# EAGLE design Main_Board (EAGLE 9.2.0)
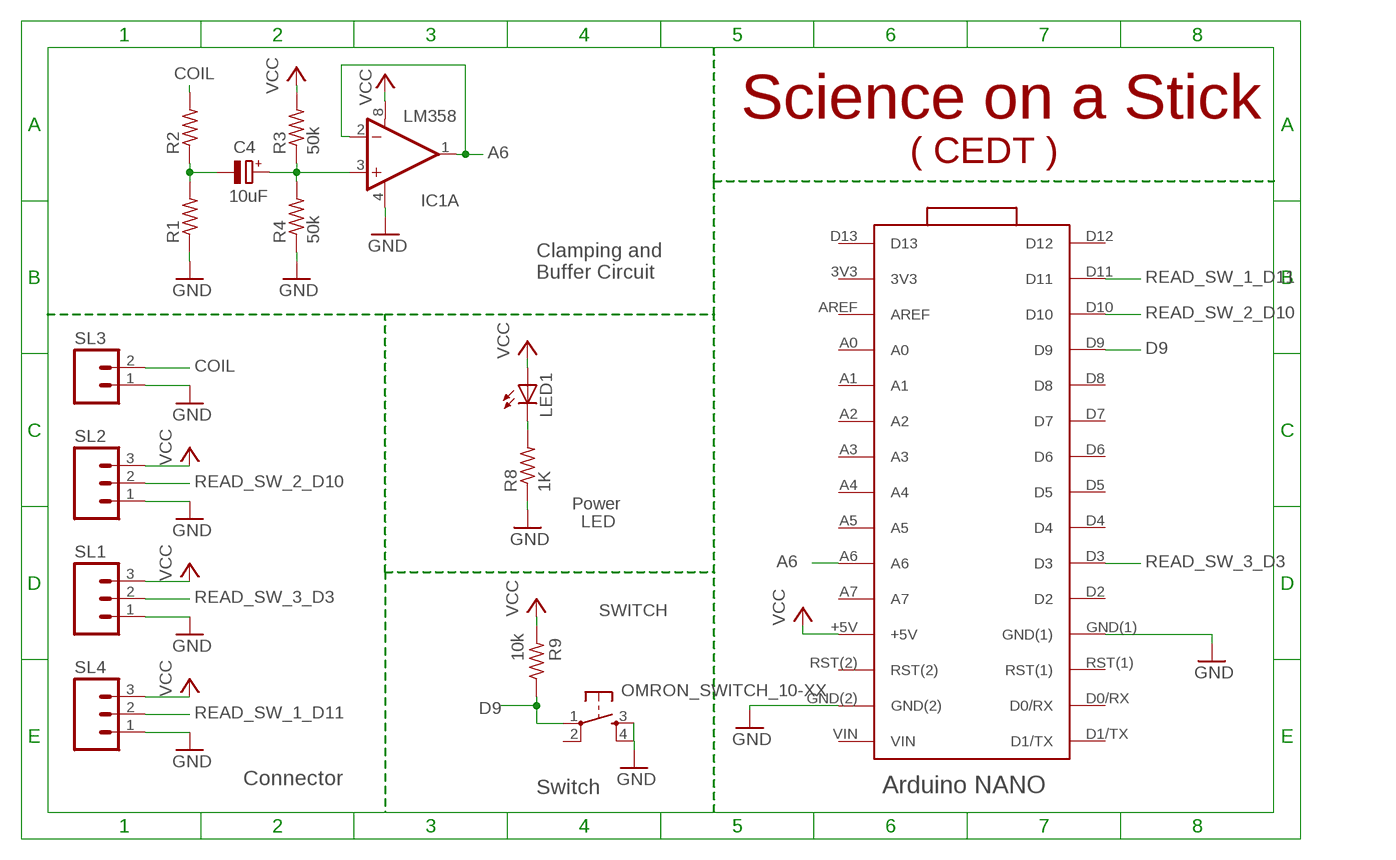
[diagram p0: schematic, sheet 1]

## Parts
C4  10uF  CPOL-EUE2.5-5  [E2,5-5]
IC1  LM358  OPAMP-DUALDIP  [DIP08]
LED1  LED3MM  [LED3MM]
R1  RESISTOR0207/7  [0207/7]
R2  RESISTOR0207/7  [0207/7]
R3  50k  RESISTOR0207/7  [0207/7]
R4  50k  RESISTOR0207/7  [0207/7]
R8  1K  RESISTOR0207/7  [0207/7]
R9  10k  RESISTOR0207/7  [0207/7]
SL1  M03  [03P]
SL2  M03  [03P]
SL3  M02  [02P]
SL4  M03  [03P]
SWITCH  OMRON_SWITCH_10-XX  [B3F-10XX]
U$1  ARDUINO_NANO_3_ARDUINO(NANO_3.0)  [ARDUINO_NANO_3_ARDUINO_NANO_30PIN]

## Nets
A6: IC1.1(A:OUT) IC1.2(A:-IN) U$1.A6
CLAMP_SIGNAL: C4.+ IC1.3(A:+IN) R3.1 R4.2
COIL: R2.2 SL3.2
D9: R9.1 SWITCH.1(P) U$1.D9
GND: IC1.4(A:V-) R1.1 R4.1 R8.1 SL1.1 SL2.1 SL3.1 SL4.1 SWITCH.3(S) SWITCH.4(S1) U$1.GND(1) U$1.GND(2)
N$1: C4.- R1.2 R2.1
N$6: LED1.K(C) R8.2
READ_SW_1_D11: SL4.2 U$1.D11
READ_SW_2_D10: SL2.2 U$1.D10
READ_SW_3_D3: SL1.2 U$1.D3
VCC: IC1.8(A:V+) LED1.A R3.2 R9.2 SL1.3 SL2.3 SL4.3 U$1.+5V
Unconnected: IC1.5(B:+IN) IC1.6(B:-IN) IC1.7(B:OUT) SWITCH.2(P1) U$1.3V3 U$1.A0 U$1.A1 U$1.A2 U$1.A3 U$1.A4 U$1.A5 U$1.A7 U$1.AREF U$1.D0/RX U$1.D1/TX U$1.D2 U$1.D4 U$1.D5 U$1.D6 U$1.D7 U$1.D8 U$1.D12 U$1.D13 U$1.RST(1) U$1.RST(2) U$1.VIN

## Notes on the sheet
- Science on a Stick
- ( CEDT )
- Clamping and 
  Buffer Circuit
- Power
- LED
- Arduino NANO
- Connector
- Switch

## Library data of the parts
C4 = MSP-MB_V12:CPOL-EU: POLARIZED CAPACITOR, European symbol
IC1 = SparkFun-AnalogIC:OPAMP-DUAL: Generic op-amp footprint
LED1 = CEDT_JANUARY_2015_v5:LED
R1-R4 = Arduino_Hackathon_v5:RESISTOR
R8 R9 = CEDT_JANUARY_2015_v5:RESISTOR
SL1 SL2 SL4 = msp framework:M03: AMP QUICK CONNECTOR
SL3 = CEDT_JANUARY_2015_v5:M02: AMP QUICK CONNECTOR
SWITCH = CEDT_JANUARY_2015_v5:OMRON_SWITCH
U$1 = 1 D hour glass_V1:ARDUINO_NANO_3_ARDUINO(NANO_3.0)

## Board
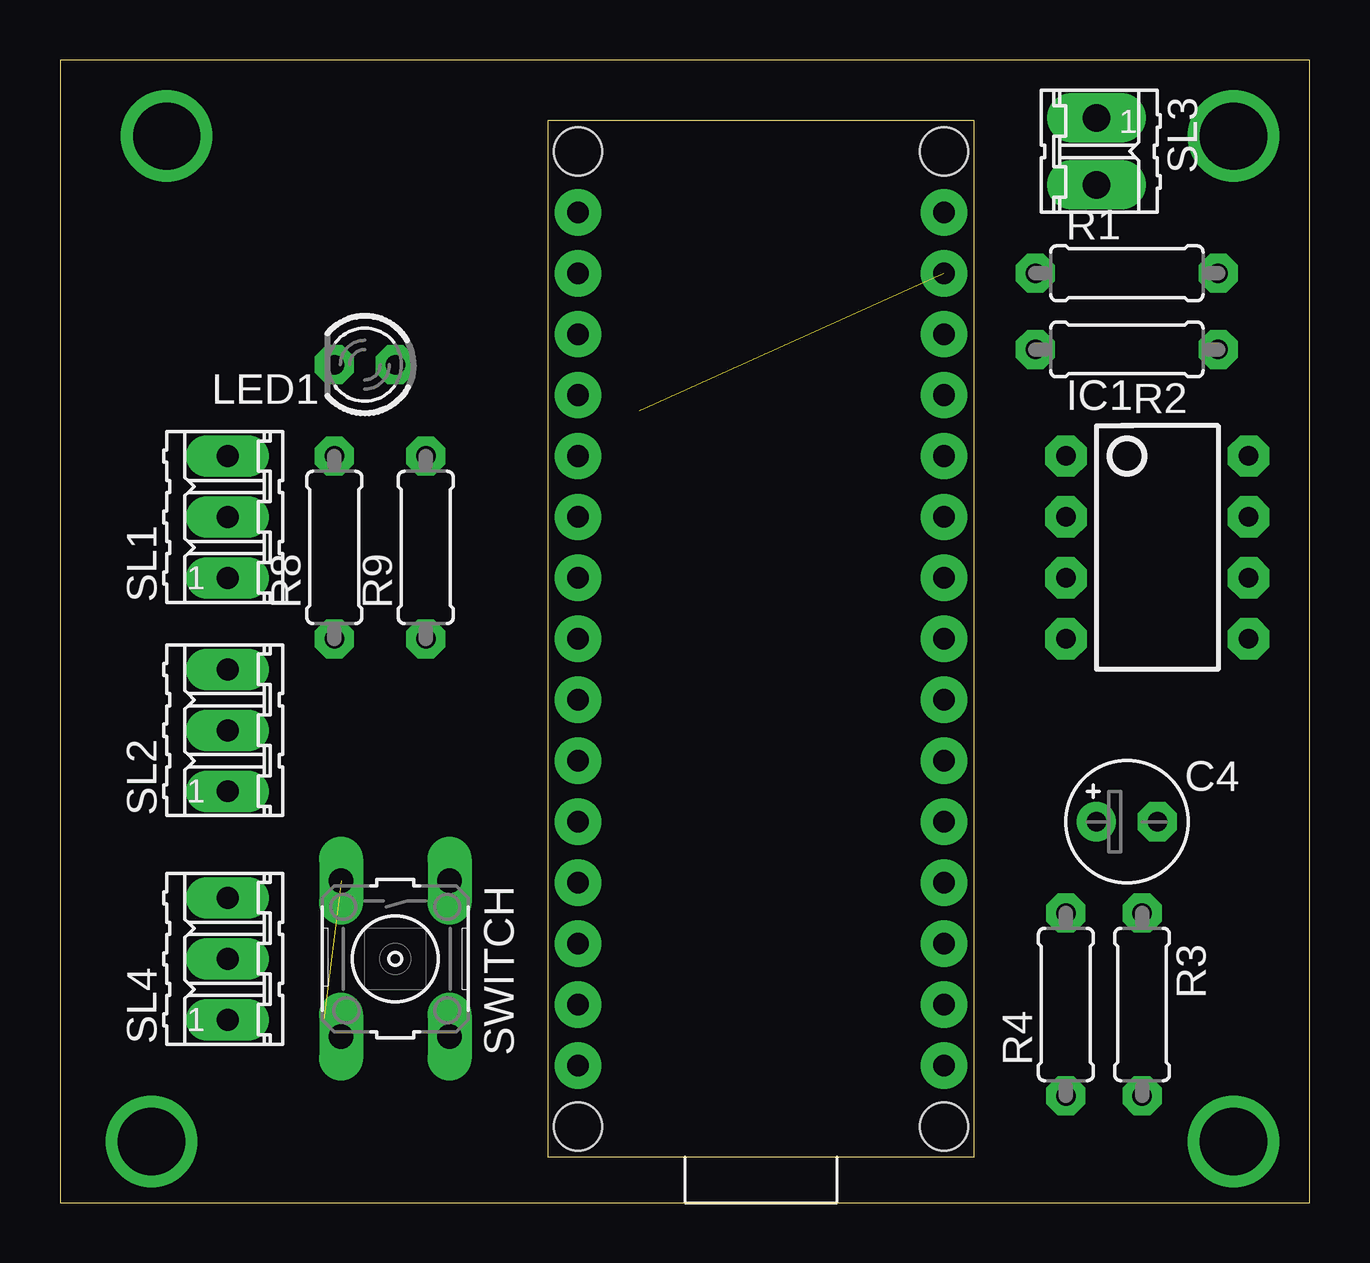
[diagram p1: board, top side]
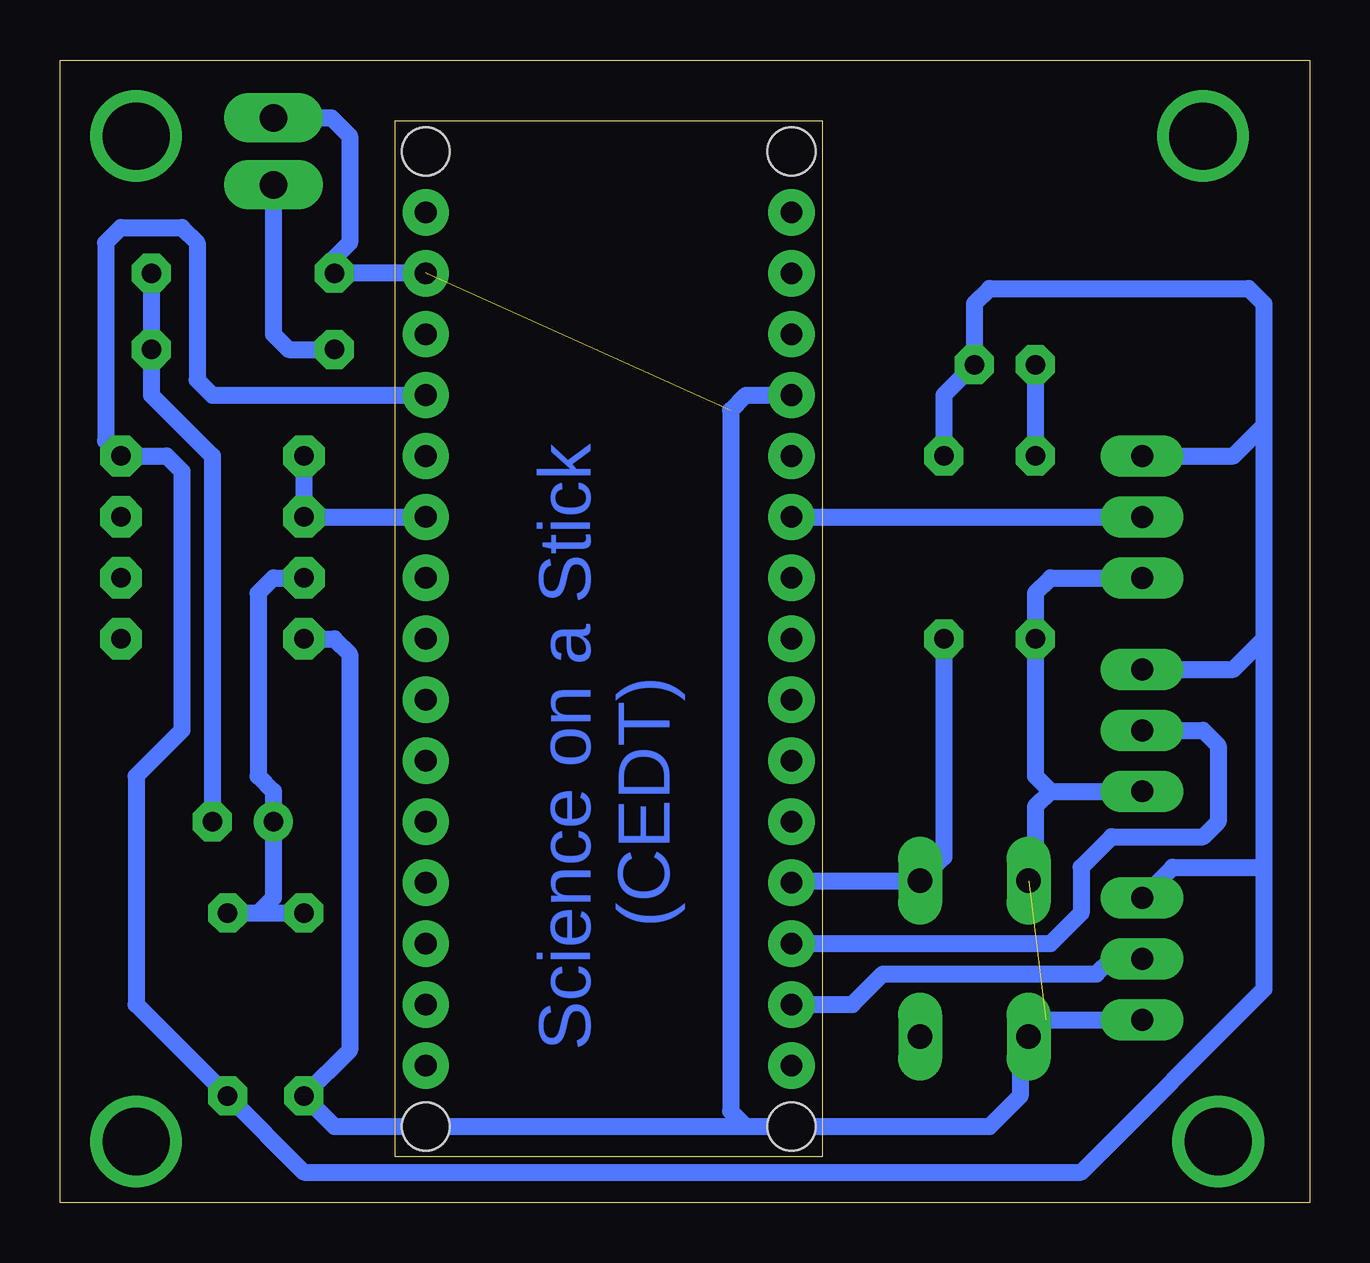
[diagram p2: board, bottom side, seen from below]

Size 52.07 x 47.62 mm. Coordinates in mm from the lower left corner, seen from the top.
Outline: 0,0 52.07,0 52.07,47.62 0,47.62 0,0
Copper layers (1*16): Top 0.035mm / dielectric 1.5mm / Bottom 0.035mm
Design rules "default *": minimum track width 10mil, minimum drill 24mil, track to track 16mil, track to pad 16mil, pad to pad 16mil, via to via 16mil, smd to smd 16mil, copper to edge 40mil, drill to drill 8mil, minimum pad ring 16mil, minimum via ring 16mil, stop-mask expansion 4mil, vias tented up to drill 0mil, thermal gap 10mil

### Footprints (pad centres in the part's own frame; a part is rotated, then mirrored left to right if it is on the bottom)
E2,5-5 = drill 0.813 pad 1.6: + -1.27,0 | drill 0.813 pad 1.6 octagon: - 1.27,0
DIP08 = drill 0.813 pad 1.727 octagon: 1 -3.81,-3.81; 2 -1.27,-3.81; 3 1.27,-3.81; 4 3.81,-3.81; 5 3.81,3.81; 6 1.27,3.81; 7 -1.27,3.81; 8 -3.81,3.81
LED3MM = drill 0.813 octagon: A -1.27,0; K 1.27,0
0207/7 = drill 0.813 octagon: 1 -3.81,0; 2 3.81,0
03P = drill 0.914 long: 1 -2.54,0; 2 0,0; 3 2.54,0
02P = drill 1.143 long: 1 -1.397,0; 2 1.397,0
B3F-10XX = drill 1.016 long: 1 -3.251,2.261; 2 3.251,2.261; 3 -3.251,-2.261; 4 3.251,-2.261
ARDUINO_NANO_3_ARDUINO_NANO_30PIN = drill 0.9 pad 1.93: 3V3 16.51,6.35; +5V 16.51,31.75; A0 16.51,11.43; A1 16.51,13.97; A2 16.51,16.51; A3 16.51,19.05; A4 16.51,21.59; A5 16.51,24.13; A6 16.51,26.67; A7 16.51,29.21; AREF 16.51,8.89; D0/RX 1.27,36.83; D1/TX 1.27,39.37; D2 1.27,29.21; D3 1.27,26.67; D4 1.27,24.13; D5 1.27,21.59; D6 1.27,19.05; D7 1.27,16.51; D8 1.27,13.97; D9 1.27,11.43; D10 1.27,8.89; D11 1.27,6.35; D12 1.27,3.81; D13 16.51,3.81; GND(1) 1.27,31.75; GND(2) 16.51,36.83; RST(1) 1.27,34.29; RST(2) 16.51,34.29; VIN 16.51,39.37 | hole 2: 1.27,41.91; 16.51,41.91; 16.51,1.27; 1.27,1.27

### Placement (x,y rotation side)
C4  44.45,15.88 0 top
IC1  45.72,27.3 270 top
LED1  12.7,34.92 180 top
R1  44.45,38.73 0 top
R2  44.45,35.56 180 top
R3  45.09,8.26 270 top
R4  41.91,8.26 90 top
R8  11.43,27.3 90 top
R9  15.24,27.3 90 top
SL1  6.99,28.57 90 top
SL2  6.99,19.68 90 top
SL3  43.18,43.81 270 top
SL4  6.99,10.16 90 top
SWITCH  13.97,10.16 270 top
U$1  20.32,1.91 0 top

### Tracks (layer width: path | path; a pad name or v marks a point on that pad's centre or on a via)
A6
  Bottom 0.711: IC1.1 IC1.2 U$1.A6
CLAMP_SIGNAL
  Bottom 0.711: IC1.3 43.18,26.04 43.81,25.4 43.81,17.78 43.18,17.14 C4.+ 43.18,12.7 43.81,12.06 | 43.81,12.06 R4.2 | R3.1 43.81,12.06
COIL
  Bottom 0.711: SL3.2 43.18,36.2 42.55,35.56 R2.2
D9
  Bottom 0.61: U$1.D9 21.51,13.41
  Bottom 0.711: 21.51,13.41 SWITCH.1 15.24,14.4 R9.1
GND  (2 unrouted)
  Bottom 0.711: SL4.1 11,7.62 SWITCH.4 12.06,6.55 12.06,4.45 13.34,3.17 23.5,3.17 | 10.79,17.14 SL2.1 | 10.79,17.14 11.43,16.51 11.43,13.69 SWITCH.3 | U$1.GND(1) 23.5,33.66 24.13,33.02 24.13,3.81 23.5,3.17 | 23.5,3.17 40.64,3.17 R4.1 40.01,6.35 40.01,22.86 40.64,23.5 IC1.4 | 10.79,17.14 11.43,17.78 R8.1 11.43,25.4 10.79,26.04 SL1.1 | SL3.1 40.77,45.21 40.01,44.45 40.01,40.01 40.64,39.37 R1.1 U$1.GND(2)
N$1
  Bottom 0.711: R1.2 R2.1 48.26,33.66 45.72,31.11 C4.-
N$2  (via drill 2.8)
  other vias: 4.45,44.45
N$3  (via drill 2.8)
  other vias: 48.9,44.45
N$4  (via drill 2.8)
  other vias: 3.81,2.54
N$6
  Bottom 0.711: LED1.K R8.2
N$7  (via drill 2.8)
  other vias: 48.9,2.54
READ_SW_1_D11
  Bottom 0.711: SL4.2 8.26,10.16 8.89,9.53 17.78,9.53 19.05,8.26 U$1.D11
READ_SW_2_D10
  Bottom 0.711: SL2.2 4.45,19.68 3.81,19.05 3.81,15.88 4.45,15.24 8.26,15.24 9.53,13.97 9.53,12.06 10.79,10.79 U$1.D10
READ_SW_3_D3
  Bottom 0.711: U$1.D3 SL1.2
VCC
  Bottom 0.711: 1.91,32.38 1.91,37.47 2.54,38.1 13.34,38.1 13.97,37.47 LED1.A 15.24,33.66 R9.2 | 1.91,32.38 1.91,23.5 | 1.91,23.5 1.91,13.97 | SL4.3 5.71,13.97 1.91,13.97 | SL2.3 3.17,22.23 1.91,23.5 | SL1.3 3.17,31.11 1.91,32.38 | U$1.+5V 45.72,33.66 46.35,34.29 46.35,40.01 46.99,40.64 49.53,40.64 50.16,40.01 50.16,31.75 IC1.8 47.62,31.11 46.99,30.48 46.99,19.68 48.9,17.78 48.9,8.26 R3.2 41.91,1.27 9.53,1.27 1.91,8.89 1.91,13.97

### Text on the board
Bottom: Science on a Stick / (CEDT)